# EAGLE design 7Segment-Display-RS232 (EAGLE 6.2)
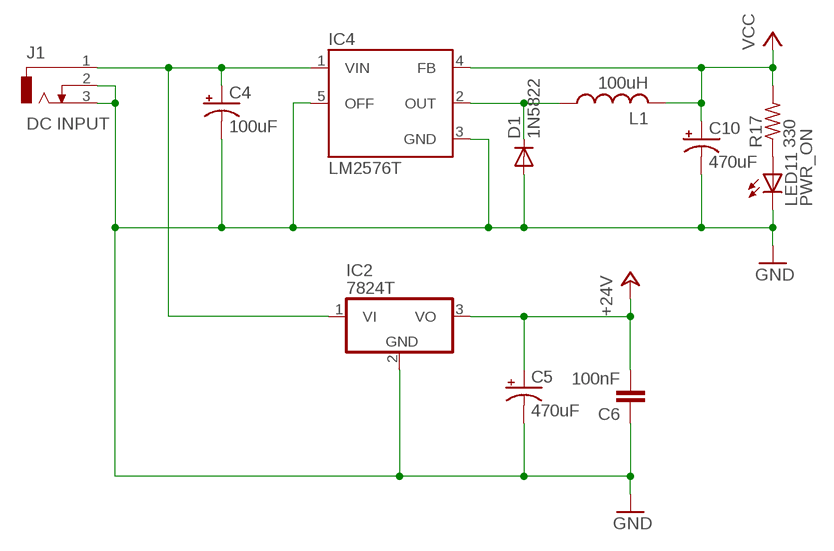
[diagram p0: schematic, sheet 1, part 1 of 2]
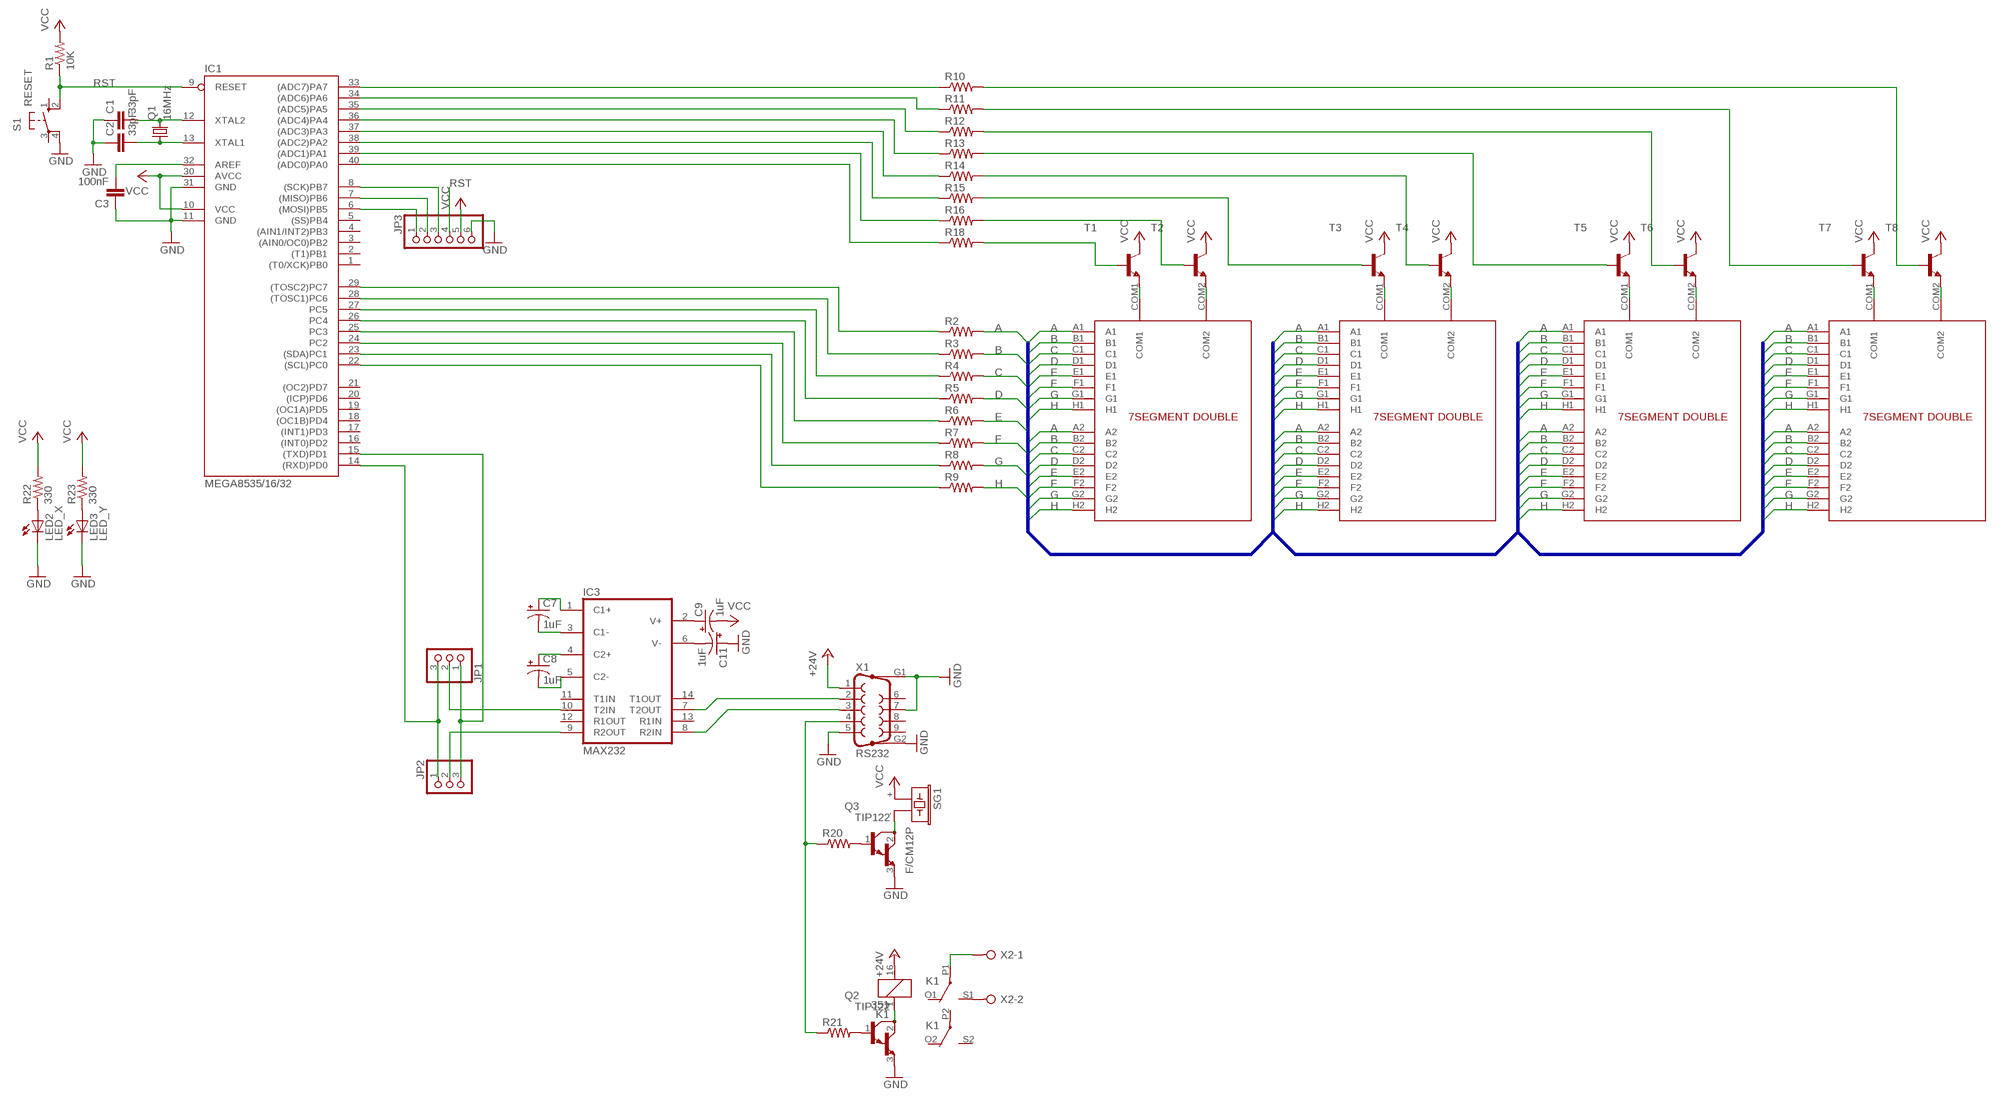
[diagram p1: schematic, sheet 1, part 2 of 2]

## Parts
C1  33pF  C-EU025-024X044  [C025-024X044]
C2  33pF  C-EU025-024X044  [C025-024X044]
C3  100nF  C-EU025-024X044  [C025-024X044]
C4  100uF  CPOL-USE2.5-6  [E2,5-6]
C5  470uF  CPOL-USE3.5-8  [E3,5-8]
C6  100nF  C-EU025-024X044  [C025-024X044]
C7  1uF  CPOL-USE2-4  [E2-4]
C8  1uF  CPOL-USE2-4  [E2-4]
C9  1uF  CPOL-USE2-4  [E2-4]
C10  470uF  CPOL-USE3.5-8  [E3,5-8]
C11  1uF  CPOL-USE2-4  [E2-4]
D1  1N5822  1N5400  [DO201-15]
IC1  MEGA8535/16/32  MEGA8535-P  [DIL40]
IC2  7824T  [TO220H]
IC3  MAX232  [DIL16]
IC4  LM2576T  [TO220-5]
J1  DC INPUT  DCJ0202  [DCJ0202]
JP1  PINHD-1X3  [1X03]
JP2  PINHD-1X3  [1X03]
JP3  PINHD-1X6  [1X06]
K1  351  [351]
L1  100uH  L-USTJ3-U2  [TJ3-U2]
LED2  LED_X  LED3MM  [LED3MM]
LED3  LED_Y  LED3MM  [LED3MM]
LED11  PWR_ON  LED3MM  [LED3MM]
Q1  16MHz  CRYSTALHC49S  [HC49/S]
Q2  TIP122  [TO220]
Q3  TIP122  [TO220]
R1  10K  R-US_0207/10  [0207/10]
R2  R-US_0207/2V  [0207/2V]
R3  R-US_0207/2V  [0207/2V]
R4  R-US_0207/2V  [0207/2V]
R5  R-US_0207/2V  [0207/2V]
R6  R-US_0207/2V  [0207/2V]
R7  R-US_0207/2V  [0207/2V]
R8  R-US_0207/2V  [0207/2V]
R9  R-US_0207/2V  [0207/2V]
R10  R-US_0207/2V  [0207/2V]
R11  R-US_0207/2V  [0207/2V]
R12  R-US_0207/2V  [0207/2V]
R13  R-US_0207/2V  [0207/2V]
R14  R-US_0207/2V  [0207/2V]
R15  R-US_0207/2V  [0207/2V]
R16  R-US_0207/2V  [0207/2V]
R17  330  R-US_0207/2V  [0207/2V]
R18  R-US_0207/2V  [0207/2V]
R20  R-US_0207/2V  [0207/2V]
R21  R-US_0207/2V  [0207/2V]
R22  330  R-US_0207/2V  [0207/2V]
R23  330  R-US_0207/2V  [0207/2V]
S1  RESET  10-XX  [B3F-10XX]
SG1  F/CM12P  [F/CM12P]
T1  2N2222-NPN-TO92-EBC  [TO92-EBC]
T2  2N2222-NPN-TO92-EBC  [TO92-EBC]
T3  2N2222-NPN-TO92-EBC  [TO92-EBC]
T4  2N2222-NPN-TO92-EBC  [TO92-EBC]
T5  2N2222-NPN-TO92-EBC  [TO92-EBC]
T6  2N2222-NPN-TO92-EBC  [TO92-EBC]
T7  2N2222-NPN-TO92-EBC  [TO92-EBC]
T8  2N2222-NPN-TO92-EBC  [TO92-EBC]
U$1  7SEGMENT_DOUBLE  [7SEGMENT_DOUBLE]
U$2  7SEGMENT_DOUBLE  [7SEGMENT_DOUBLE]
U$3  7SEGMENT_DOUBLE  [7SEGMENT_DOUBLE]
U$4  7SEGMENT_DOUBLE  [7SEGMENT_DOUBLE]
X1  RS232  F09HP  [F09HP]
X2  W237-02P  [W237-132]

## Nets
+24V: C5.+ C6.2 IC2.3(VO) K1.16 X1.1
A: R2.2 U$1.A1 U$1.A2 U$2.A1 U$2.A2 U$3.A1 U$3.A2 U$4.A1 U$4.A2
B: R3.2 U$1.B1 U$1.B2 U$2.B1 U$2.B2 U$3.B1 U$3.B2 U$4.B1 U$4.B2
C: R4.2 U$1.C1 U$1.C2 U$2.C1 U$2.C2 U$3.C1 U$3.C2 U$4.C1 U$4.C2
D: R5.2 U$1.D1 U$1.D2 U$2.D1 U$2.D2 U$3.D1 U$3.D2 U$4.D1 U$4.D2
E: R6.2 U$1.E1 U$1.E2 U$2.E1 U$2.E2 U$3.E1 U$3.E2 U$4.E1 U$4.E2
F: R7.2 U$1.F1 U$1.F2 U$2.F1 U$2.F2 U$3.F1 U$3.F2 U$4.F1 U$4.F2
G: R8.2 U$1.G1 U$1.G2 U$2.G1 U$2.G2 U$3.G1 U$3.G2 U$4.G1 U$4.G2
GND: C1.1 C2.1 C3.1 C4.- C5.- C6.1 C10.- C11.+ D1.A IC1.11(GND) IC1.31(GND) IC2.2(GND) IC4.3(GND) IC4.5(OFF) J1.2 J1.3 JP3.6 LED2.K(C) LED3.K(C) LED11.K(C) Q2.3(E) Q3.3(E) S1.4(P1) X1.5 X1.7 X1.G1 X1.G2
H: R9.2 U$1.H1 U$1.H2 U$2.H1 U$2.H2 U$3.H1 U$3.H2 U$4.H1 U$4.H2
N$1: T8.E U$4.COM2
N$2: T7.E U$4.COM1
N$3: C1.2 IC1.12(XTAL2) Q1.2
N$4: T1.E U$1.COM1
N$5: T2.E U$1.COM2
N$6: T3.E U$2.COM1
N$7: T4.E U$2.COM2
N$8: T5.E U$3.COM1
N$9: T6.E U$3.COM2
N$10: C2.2 IC1.13(XTAL1) Q1.1
N$11: C3.2 IC1.32(AREF)
N$12: C4.+ IC2.1(VI) IC4.1(VIN) J1.1
N$13: R18.2 T1.B
N$14: R16.2 T2.B
N$15: R15.2 T3.B
N$16: R14.2 T4.B
N$17: R13.2 T5.B
N$18: R12.2 T6.B
N$19: R11.2 T7.B
N$20: R10.2 T8.B
N$21: IC1.33((ADC7)PA7) R10.1
N$22: IC1.34((ADC6)PA6) R11.1
N$23: IC1.35((ADC5)PA5) R12.1
N$24: IC1.36((ADC4)PA4) R13.1
N$25: IC1.37((ADC3)PA3) R14.1
N$26: IC1.38((ADC2)PA2) R15.1
N$27: IC1.39((ADC1)PA1) R16.1
N$28: IC1.40((ADC0)PA0) R18.1
N$29: IC1.29((TOSC2)PC7) R2.1
N$30: IC1.28((TOSC1)PC6) R3.1
N$31: IC1.27(PC5) R4.1
N$32: D1.C IC4.2(OUT) L1.1
N$33: LED11.A R17.1
N$34: IC1.26(PC4) R5.1
N$35: IC1.25(PC3) R6.1
N$36: IC1.24(PC2) R7.1
N$37: IC1.23((SDA)PC1) R8.1
N$38: IC1.22((SCL)PC0) R9.1
N$39: C7.- IC3.3(C1-)
N$41: Q3.1(B) R20.2
N$42: R20.1 R21.1 X1.4
N$43: Q2.1(B) R21.2
N$44: C8.+ IC3.4(C2+)
N$45: C7.+ IC3.1(C1+)
N$46: C8.- IC3.5(C2-)
N$47: C9.+ IC3.2(V+)
N$48: C11.- IC3.6(V-)
N$49: IC3.7(T2OUT) X1.2
N$50: IC3.8(R2IN) X1.3
N$51: IC1.14((RXD)PD0) JP1.3 JP2.1
N$52: IC1.15((TXD)PD1) JP1.1 JP2.3
N$53: IC3.9(R2OUT) JP2.2
N$54: IC3.10(T2IN) JP1.2
N$55: LED3.A R23.1
N$56: LED2.A R22.1
N$57: IC1.6((MOSI)PB5) JP3.1
N$58: IC1.7((MISO)PB6) JP3.2
N$59: IC1.8((SCK)PB7) JP3.3
N$60: Q3.2(C) SG1.-
N$61: K1.1 Q2.2(C)
N$62: K1.S1(2:S) X2.2
N$63: K1.P1(2:P) X2.1
RST: IC1.9(RESET) JP3.4 R1.1 S1.2(S1)
VCC: C9.- C10.+ IC1.10(VCC) IC1.30(AVCC) IC4.4(FB) JP3.5 L1.2 R1.2 R17.2 R22.2 R23.2 SG1.+ T1.C T2.C T3.C T4.C T5.C T6.C T7.C T8.C
Unconnected: IC1.1((T0/XCK)PB0) IC1.2((T1)PB1) IC1.3((AIN0/OC0)PB2) IC1.4((AIN1/INT2)PB3) IC1.5((SS)PB4) IC1.16((INT0)PD2) IC1.17((INT1)PD3) IC1.18((OC1B)PD4) IC1.19((OC1A)PD5) IC1.20((ICP)PD6) IC1.21((OC2)PD7) IC3.11(T1IN) IC3.12(R1OUT) IC3.13(R1IN) IC3.14(T1OUT) K1.O1(2:O) K1.O2(3:O) K1.P2(3:P) K1.S2(3:S) S1.1(S) S1.3(P) X1.6 X1.8 X1.9

## Buses
7SEG:A,B,C,D,E,F,G,H

## Power pins joined to a net without a drawn wire
GND: IC3.15(GND)
VCC: IC3.16(VCC)

## Library data of the parts
C1-C3 C6 = resistor:C-EU: CAPACITOR, European symbol
C4 C5 C7-C11 = resistor:CPOL-US: POLARIZED CAPACITOR, American symbol
D1 = diode:1N5400: DIODE standard rectifier, 3 A, 50 V (Motorola)
IC1 = atmel:MEGA8535-P: MICROCONTROLLER 8 Kbytes FLASH 512 bytes SRAM 512 bytes EEPROM USART 8-channel 10 bit ADC Source: avr.lbr; MPN: ATMEGA8535-16PU; OC_FARNELL: 9171444; OC_NEWARK: 01M6909
IC2 = linear:78*: Positive VOLTAGE REGULATOR Source: http://cache.national.com/ds/LM/LM78L05.pdf http://www.fairchildsemi.com/ds/LM/LM7805.pdf
IC3 = maxim:MAX232: RS232 TRANSEIVER; MF: MAXIM; MPN: MAX232ACPE+; OC_FARNELL: 9723773; OC_NEWARK: 68K4544
IC4 = v-reg-3:LM2576: National Semiconductor <http://www.national.com> 3.0A "Simple Switcher"(c) 52kHz, Vout 1.23-37V (HV: 57V), Vin 40V (HV: 60V), 50µA standby current
J1 = con-jack:DCJ0202: DC POWER JACK Source: DCJ0202.pdf; OC_FARNELL: unknown; OC_NEWARK: unknown
JP1 JP2 = pinhead:PINHD-1X3: PIN HEADER
JP3 = pinhead:PINHD-1X6: PIN HEADER
K1 = relay:351: RELAY 2 x switch, Omron; OC_FARNELL: unknown; OC_NEWARK: unknown
L1 = resistor:L-US: INDUCTOR, American symbol
LED2 LED3 LED11 = led:LED: LED OSRAM: - CHIPLED LG R971, LG N971, LY N971, LG Q971, LY Q971, LO R971, LY R971 LH N974, LH R974 LS Q976, LO Q976, LY Q976 LO Q996 - Hyper CHIPLED LW Q18S LB Q993, LB Q99A, LB R99A - SideLED LS A670, LO A670, LY A670, LG A670, LP A670 LB A673, LV A673, LT A673, LW A673 LH A674 LY A675 LS A676, LA A676, LO A676, LY A676, LW A676 LS A679, LY A679, LG A679 - Hyper Micro SIDELED® LS Y876, LA Y876, LO Y876, LY Y876 LT Y87S - SmartLED LW L88C, LW L88S LB L89C, LB L89S, LG L890 LS L89K, LO L89K, LY L89K LS L896, LA L896, LO L896, LY L896 - TOPLED LS T670, LO T670, LY T670, LG T670, LP T670 LSG T670, LSP T670, LSY T670, LOP T670, LYG T670 LG T671, LOG T671, LSG T671 LB T673, LV T673, LT T673, LW T673 LH T674 LS T676, LA T676, LO T676, LY T676, LB T676, LH T676, LSB T676, LW T676 LB T67C, LV T67C, LT T67C, LS T67K, LO T67K, LY T67K, LW E67C LS E67B, LA E67B, LO E67B, LY E67B, LB E67C, LV E67C, LT E67C LW T67C LS T679, LY T679, LG T679 LS T770, LO T770, LY T770, LG T770, LP T770 LB T773, LV T773, LT T773, LW T773 LH T774 LS E675, LA E675, LY E675, LS T675 LS T776, LA T776, LO T776, LY T776, LB T776 LHGB T686 LT T68C, LB T68C - Hyper Mini TOPLED® LB M676 - Mini TOPLED Santana® LG M470 LS M47K, LO M47K, LY M47K Source: http://www.osram.convergy.de LUXEON: - LUMILED® LXK2-PW12-R00, LXK2-PW12-S00, LXK2-PW14-U00, LXK2-PW14-V00 LXK2-PM12-R00, LXK2-PM12-S00, LXK2-PM14-U00 LXK2-PE12-Q00, LXK2-PE12-R00, LXK2-PE12-S00, LXK2-PE14-T00, LXK2-PE14-U00 LXK2-PB12-K00, LXK2-PB12-L00, LXK2-PB12-M00, LXK2-PB14-N00, LXK2-PB14-P00, LXK2-PB14-Q00 LXK2-PR12-L00, LXK2-PR12-M00, LXK2-PR14-Q00, LXK2-PR14-R00 LXK2-PD12-Q00, LXK2-PD12-R00, LXK2-PD12-S00 LXK2-PH12-R00, LXK2-PH12-S00 LXK2-PL12-P00, LXK2-PL12-Q00, LXK2-PL12-R00 Source: www.luxeon.com KINGBRIGHT: KA-3528ASYC Source: www.kingbright.com
Q1 = crystal:CRYSTAL: CRYSTAL; OC_FARNELL: 1667008; OC_NEWARK: unknown
Q2 Q3 = transistor-npn:TIP122*: NPN Darlington Transistor
R1-R18 R20-R23 = resistor:R-US_: RESISTOR, American symbol
S1 = switch-omron:10-XX: OMRON SWITCH; MPN: B3F-1000; OC_FARNELL: 176432; OC_NEWARK: 36M3542
SG1 = buzzer:F/CM12P: BUZZER Source: Buerklin; OC_FARNELL: unknown; OC_NEWARK: unknown
T1-T8 = transistor-neu-to92:*-NPN-: NPN Transistror
U$1-U$4 = 7SEGMENT_DOUBLE:7SEGMENT_DOUBLE
X1 = con-subd:F09HP: SUB-D; OC_FARNELL: unknown; OC_NEWARK: unknown
X2 = con-wago-508:W237-02P: WAGO SREW CLAMP; OC_FARNELL: unknown; OC_NEWARK: unknown

## Board
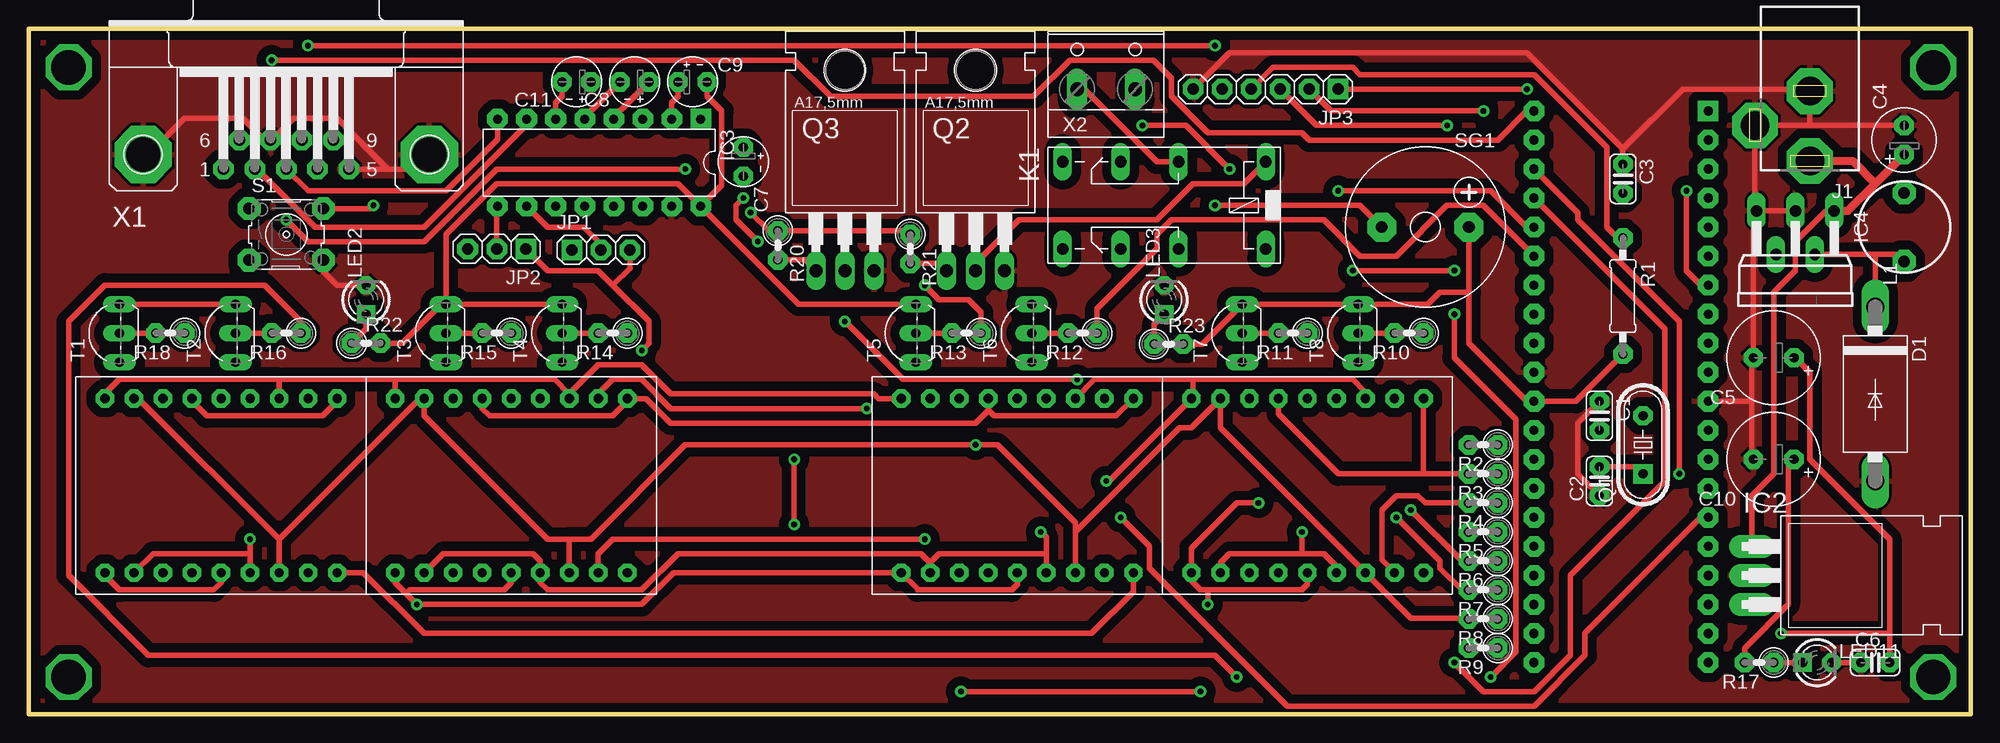
[diagram p2: board, top side]
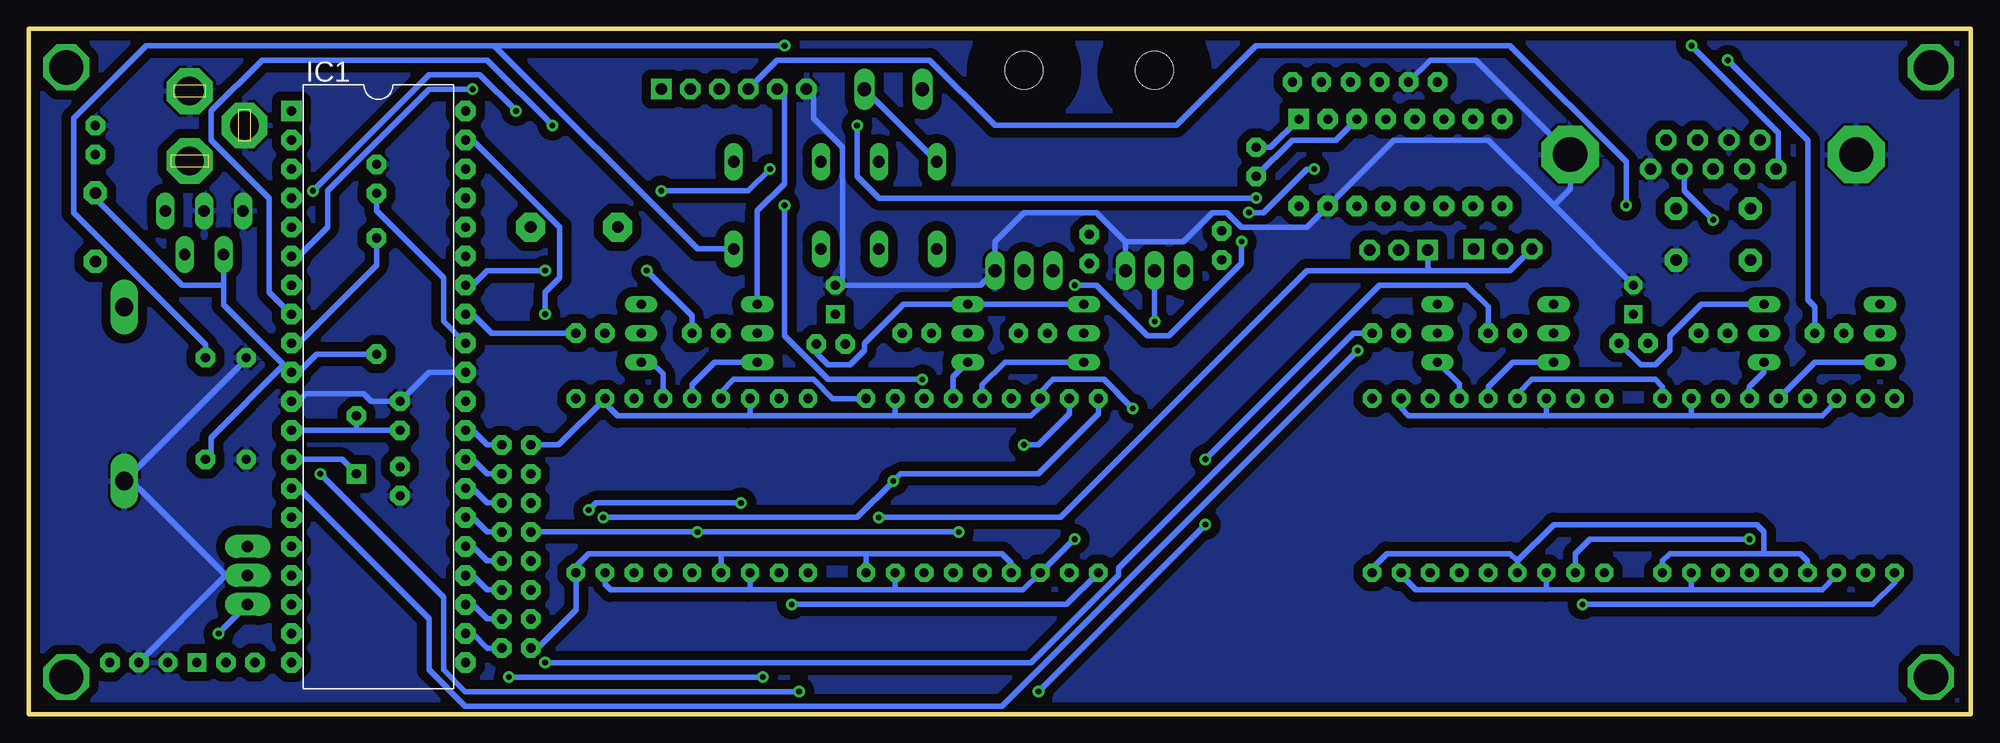
[diagram p3: board, bottom side, seen from below]

Size 170 x 60 mm. Coordinates in mm from the lower left corner, seen from the top.
Outline: 0,60 0,0 170,0 170,60 0,60
Copper layers (1*16): Top 0.035mm / dielectric 1.5mm / Bottom 0.035mm
Design rules: minimum track width 0.5mm, minimum drill 0.5mm, track to track 10mil, track to pad 10mil, pad to pad 8mil, via to via 8mil, smd to smd 8mil, copper to edge 10mil, drill to drill 8mil, minimum pad ring 12mil, minimum via ring 10mil, stop-mask expansion 4mil, vias tented up to drill 25mil, thermal gap 10mil

### Footprints (pad centres in the part's own frame; a part is rotated, then mirrored left to right if it is on the bottom)
C025-024X044 = drill 0.8 pad 1.7 octagon: 1 -1.27,0; 2 1.27,0
E2,5-6 = drill 0.8 pad 1.7 octagon: + -1.27,0; - 1.27,0
E3,5-8 = drill 0.813 pad 1.7 octagon: + -1.778,0; - 1.778,0
E2-4 = drill 0.8 pad 1.7 octagon: + -1.27,0; - 1.27,0
DO201-15 = drill 1.6 long: A 7.62,0; C -7.62,0
DIL40 = drill 0.8 pad 1.8 square: 1 -24.13,-7.62 | drill 0.8 pad 1.8 octagon: 2 -21.59,-7.62; 3 -19.05,-7.62; 4 -16.51,-7.62; 5 -13.97,-7.62; 6 -11.43,-7.62; 7 -8.89,-7.62; 8 -6.35,-7.62; 9 -3.81,-7.62; 10 -1.27,-7.62; 11 1.27,-7.62; 12 3.81,-7.62; 13 6.35,-7.62; 14 8.89,-7.62; 15 11.43,-7.62; 16 13.97,-7.62; 17 16.51,-7.62; 18 19.05,-7.62; 19 21.59,-7.62; 20 24.13,-7.62; 21 24.13,7.62; 22 21.59,7.62; 23 19.05,7.62; 24 16.51,7.62; 25 13.97,7.62; 26 11.43,7.62; 27 8.89,7.62; 28 6.35,7.62; 29 3.81,7.62; 30 1.27,7.62; 31 -1.27,7.62; 32 -3.81,7.62; 33 -6.35,7.62; 34 -8.89,7.62; 35 -11.43,7.62; 36 -13.97,7.62; 37 -16.51,7.62; 38 -19.05,7.62; 39 -21.59,7.62; 40 -24.13,7.62
TO220H = drill 1 pad 2 long: 1 -2.54,-10.16; 2 0,-10.16; 3 2.54,-10.16
DIL16 = drill 0.8 pad 1.8 square: 1 -8.89,-3.81 | drill 0.8 pad 1.8 octagon: 2 -6.35,-3.81; 3 -3.81,-3.81; 4 -1.27,-3.81; 5 1.27,-3.81; 6 3.81,-3.81; 7 6.35,-3.81; 8 8.89,-3.81; 9 8.89,3.81; 10 6.35,3.81; 11 3.81,3.81; 12 1.27,3.81; 13 -1.27,3.81; 14 -3.81,3.81; 15 -6.35,3.81; 16 -8.89,3.81
TO220-5 = drill 1 long: 1 -3.4,-8.4; 2 -1.7,-4.59; 3 0,-8.4; 4 1.7,-4.59; 5 3.4,-8.4
DCJ0202 = drill 2.5 pad 4 octagon: 1 0,3.1; 2 4.8,0; 3 0,-3
1X03 = drill 1 pad 1.8 square: 1 -2.54,0 | drill 1 pad 1.8 octagon: 2 0,0; 3 2.54,0
1X06 = drill 1 pad 1.8 square: 1 -6.35,0 | drill 1 pad 1.8 octagon: 2 -3.81,0; 3 -1.27,0; 4 1.27,0; 5 3.81,0; 6 6.35,0
351 = drill 1.016 long: 1 -3.81,-3.81; 16 -3.81,3.81; O1 8.89,-3.81; O2 8.89,3.81; P1 3.81,-3.81; P2 3.81,3.81; S1 13.97,-3.81; S2 13.97,3.81
TJ3-U2 = drill 1 pad 2 octagon: 1 -3,0; 2 3,0
LED3MM = drill 0.8 pad 1.6 square: A -1.27,0 | drill 0.8 pad 1.6 octagon: K 1.27,0
HC49/S = drill 0.8 pad 1.7 square: 1 -2.54,0 | drill 0.8 pad 1.7 octagon: 2 2.54,0
TO220 = drill 1.118 long: 1 -2.54,-6.35; 2 0,-6.35; 3 2.54,-6.35 | hole 3.302: 0,11.176
0207/10 = drill 0.8 pad 1.7 octagon: 1 -5.08,0; 2 5.08,0
0207/2V = drill 0.813 pad 1.7 octagon: 1 -1.27,0; 2 1.27,0
B3F-10XX = drill 1 pad 2 octagon: 1 -3.251,2.261; 2 3.251,2.261; 3 -3.251,-2.261; 4 3.251,-2.261
F/CM12P = drill 1.016 pad 2.54 octagon: + 3.81,0; - -3.81,0
TO92-EBC = drill 0.813 long: B 0,-1.27; C 2.54,-1.27; E -2.54,-1.27
7SEGMENT_DOUBLE = drill 0.8 pad 1.6 octagon: A1 -5.08,8.255; A2 7.62,8.255; B1 -2.54,8.255; B2 10.16,8.255; C1 -5.08,-6.985; C2 7.62,-6.985; COM1 0,8.255; COM2 2.54,8.255; D1 -7.62,-6.985; D2 2.54,-6.985; E1 -10.16,-6.985; E2 0,-6.985; F1 -10.16,8.255; F2 5.08,8.255; G1 -7.62,8.255; G2 5.08,-6.985; H1 -2.54,-6.985; H2 10.16,-6.985
F09HP = drill 1 pad 1.8 octagon: 1 -5.486,-1.27; 2 -2.743,-1.27; 3 0,-1.27; 4 2.743,-1.27; 5 5.486,-1.27; 6 -4.115,1.27; 7 -1.372,1.27; 8 1.372,1.27; 9 4.115,1.27 | drill 3 pad 5 octagon: G1 -12.522,0; G2 12.522,0
W237-132 = drill 1.194 long: 1 -2.54,-0.635; 2 2.54,-0.635

### Placement (x,y rotation side)
C1  137.49,26.12 270 top
C2  137.49,20.41 90 top
C3  139.54,46.84 270 top
C4  164.16,50.25 90 top
C5  152.73,31.2 180 top
C6  161.62,4.53 0 top
C7  62.56,48.34 270 top
C8  53.03,55.33 180 top
C9  58.12,55.33 0 top
C10  152.73,22.31 180 top
C11  47.96,55.33 180 top
D1  161.62,28.03 270 top
IC1  139.38,28.66 270 bottom
IC2  160.99,12.15 270 top
IC3  49.94,48.27 180 top
IC4  154.63,35.64 180 top
J1  155.91,51.52 180 top
JP1  50.09,40.64 0 top
JP2  40.97,40.72 180 top
JP3  108.26,54.69 180 top
K1  104.47,44.53 180 top
L1  164.16,42.63 90 top
LED2  29.54,36.28 90 top
LED3  99.39,36.28 90 top
LED11  156.54,4.53 0 top
Q1  141.3,23.58 90 top
Q2  82.88,45.17 0 top
Q3  71.45,45.17 0 top
R1  139.54,36.59 270 top
R2  127.31,23.58 180 top
R3  127.31,21.04 180 top
R4  127.31,18.5 180 top
R5  127.31,15.96 180 top
R6  127.31,13.42 180 top
R7  127.31,10.88 180 top
R8  127.31,8.34 180 top
R9  127.31,5.8 180 top
R10  120.82,33.34 180 top
R11  110.66,33.34 180 top
R12  92.25,33.34 180 top
R13  82.09,33.34 180 top
R14  51.13,33.34 180 top
R15  40.97,33.34 180 top
R16  22.56,33.34 180 top
R17  151.46,4.53 180 top
R18  12.4,33.34 180 top
R20  65.58,41.03 270 top
R21  77.16,40.72 270 top
R22  29.54,32.47 0 top
R23  99.78,32.39 0 top
S1  22.56,42 0 top
SG1  122.25,42.63 0 top
T1  6.69,33.34 90 top
T2  16.84,33.34 90 top
T3  35.26,33.34 90 top
T4  45.42,33.34 90 top
T5  76.38,33.34 90 top
T6  86.53,33.34 90 top
T7  104.95,33.34 90 top
T8  115.11,33.34 90 top
U$1  16.84,19.38 0 top
U$2  42.25,19.38 0 top
U$3  86.53,19.38 0 top
U$4  111.94,19.38 0 top
X1  22.56,48.98 0 top
X2  94.31,55.33 0 top

### Tracks (layer width: path | path; a pad name or v marks a point on that pad's centre or on a via)
+24V  (via drill 0.5)
  Top 0.5: 162.89,7.07 162.89,15.33 155.91,22.31 155.91,29.93 154.63,31.2 C5.+ | 162.89,7.07 C6.2 | v103.84,58.5 v24.46,58.5 | 162.89,7.07 v153.37,7.07
  Bottom 0.5: K1.16 111.46,40.72 129.24,58.5 | 129.24,58.5 159.71,58.5 166.06,52.16 166.06,43.9 154.51,32.34 C5.+ | v24.46,58.5 16.84,50.89 16.84,47.71 X1.1 | 129.24,58.5 v103.84,58.5 | v153.37,7.07 IC2.3
A  (via drill 0.5)
  Top 0.5: v73.35,26.75 56.21,26.75 53.67,29.3 51.13,29.3 49.87,28.03 U$2.A2
  Bottom 0.5: 24.46,26.12 13.03,26.12 11.77,27.39 U$1.A1 | 24.46,26.12 37.16,26.12 | 37.16,26.12 49.22,26.12 49.87,26.76 U$2.A2 | R2.2 123.6,23.58 U$4.A2 119.56,27.23 118.44,26.12 107.01,26.12 | 94.31,26.12 82.25,26.12 81.46,26.91 U$3.A1 81.46,28.18 80.34,29.3 75.9,29.3 v73.35,26.75 | 94.31,26.12 107.01,26.12 | U$1.A2 24.47,26.12 24.46,26.12 | U$2.A1 37.16,26.12 | U$3.A2 94.16,26.28 94.31,26.12 | U$4.A1 106.85,26.28 107.01,26.12
B
  Top 0.5: R3.2 122.25,21.04 | 122.25,21.04 114.63,21.04 109.4,26.28 U$4.B1 | U$1.B1 14.31,27.39 15.57,26.12 25.73,26.12 27,27.39 U$1.B2 | U$2.B1 39.71,26.75 40.34,26.12 51.13,26.12 52.41,27.39 U$2.B2 54.06,27.63 56.21,25.48 82.88,25.48 84,26.6 | U$4.B2 122.09,21.19 122.25,21.04 | U$3.B1 84,26.6 | 84,26.6 84.47,26.12 95.19,26.12 U$3.B2
  Bottom 0.5: U$1.B2 27,28.67 27.64,29.3 38.43,29.3 39.71,28.02 U$2.B1 | U$3.B2 99.63,27.63 101.29,29.3 108.28,29.3 109.4,28.18 U$4.B1
C  (via drill 0.5)
  Top 0.5: R4.2 122.25,18.5 121.62,19.14 119.71,19.14 118.44,17.87 118.44,13.51 U$4.C2 | v78.44,15.33 51.13,15.33 49.87,14.06 U$2.C2
  Bottom 0.5: 24.46,10.88 13.03,10.88 11.77,12.15 U$1.C1 | 24.46,10.88 37.16,10.88 | 37.16,10.88 48.59,10.88 49.87,12.16 U$2.C2 | 94.31,10.88 82.97,10.88 U$3.C1 78.52,15.33 v78.44,15.33 | 94.31,10.88 107.01,10.88 | 107.01,10.88 119.07,10.88 119.56,11.36 U$4.C2 | U$1.C2 24.47,10.88 24.46,10.88 | U$2.C1 37.16,10.88 | U$3.C2 94.16,11.03 94.31,10.88 | U$4.C1 106.85,11.03 107.01,10.88
D  (via drill 0.5)
  Top 0.5: 111.46,14.05 105.1,14.05 104.31,13.27 U$4.D1 | 111.46,14.05 v111.46,15.96 | 89.07,14.05 79.71,14.05 78.91,13.27 | 19.39,14.05 10.89,14.05 U$1.D1 | U$1.D2 19.39,14.05 | 19.39,14.05 v19.39,15.32 v19.38,15.33 | U$3.D1 78.91,13.27 | 78.91,13.27 78.12,14.05 56.84,14.05 53.67,10.88 45.41,10.88 44.78,11.51 U$2.D2 44.78,13.41 44.15,14.05 36.53,14.05 36.29,14.05 U$2.D1 | U$3.D2 89.07,14.05 | 89.07,14.05 89.07,15.48 v88.59,15.96 | U$4.D2 114.47,12.94 113.36,14.05 111.46,14.05
  Bottom 0.5: R5.2 v111.46,15.96 v88.59,15.96 | v19.38,15.33 33.35,15.33 34.62,14.05 U$2.D1
E  (via drill 0.5)
  Top 0.5: 103.2,10.88 111.46,10.88 111.94,11.36 U$4.E2 | v120.98,17.87 125.43,13.42 R6.2 | v103.2,9.61 103.2,10.88 | U$1.E1 6.69,12.15 7.95,10.88 16.2,10.88 16.84,11.52 U$1.E2 | U$2.E1 32.09,11.51 33.03,10.56 | 33.03,10.56 v33.99,9.61 53.67,9.61 56.45,12.39 U$3.E1 77.8,10.97 77.8,10.88 86.06,10.88 86.53,11.36 U$3.E2 | 33.03,10.56 33.35,10.88 41.6,10.88 42.25,11.52 U$2.E2 | v107.65,18.5 105.74,18.5 101.78,14.53 U$4.E1 101.78,11.67 102.56,10.88 103.2,10.88
  Bottom 0.5: v120.98,17.87 120.34,18.5 v107.65,18.5 | v33.99,9.61 8.58,9.61 6.69,11.51 U$1.E1 | v103.2,9.61 79.16,9.61 U$3.E1
F  (via drill 0.5)
  Top 0.5: 101.93,29.3 93.28,29.3 U$3.F2 | 101.93,29.3 115.9,29.3 117.01,28.18 U$4.F2 | 21.92,29.3 7.95,29.3 6.69,28.03 U$1.F1 | 21.92,29.3 32.08,29.3 | 32.08,29.3 46.05,29.3 47.32,28.02 U$2.F2 47.32,28.03 49.86,30.56 53.67,30.56 56.21,28.03 73.99,28.03 74.38,27.63 U$3.F1 | v119.71,17.23 123.52,13.42 123.52,12.78 125.43,10.88 R7.2 | U$1.F2 21.92,29.29 21.92,29.3 | U$2.F1 32.09,29.29 32.08,29.3 | v94.31,20.41 94.55,20.41 U$4.F1 101.93,27.78 101.93,29.3
  Bottom 0.5: v119.71,17.23 97.49,17.23 v94.31,20.41 93.68,21.04 81.61,21.04 76.38,26.28 U$3.F1
G  (via drill 0.5)
  Top 0.5: 21.92,15.32 9.61,27.63 U$1.G1 | 47.32,15.33 49.22,15.33 57.48,23.58 v82.88,23.58 84.78,23.58 91.62,16.75 91.62,15.96 | U$1.G2 21.92,15.32 | U$2.G2 47.32,15.32 47.32,15.33 | R8.2 125.96,8.42 120.98,8.42 U$4.G2 104.31,25.09 U$4.G1 101.78,25.09 100.75,25.09 91.62,15.96 | U$3.G2 91.62,15.96 | 21.92,15.32 34.24,27.63 U$2.G1 34.62,26.11 45.41,15.33 47.32,15.33
  Bottom 0.5: U$3.G1 78.91,26.28 81.61,23.58 v82.88,23.58
GND
  Top 0.5: 155.91,51.52 J1.2 151.1,44.17 IC4.5 | 155.91,51.52 C4.- | 155.91,51.52 J1.3 155.91,54.69 144.78,54.69 139.54,49.47 | C6.1 LED11.K | C2.1 135.59,21.04 135.59,25.48 C1.1 | 150.82,27.39 150.82,22.31 C10.- | 150.82,27.39 IC1.11 | X1.G1 10.49,48.98 13.67,52.16 18.75,52.16 20.65,50.25 X1.7 21.28,50.25 23.19,52.16 27,52.16 31.44,47.71 | LED2.K 27,37.55 25.81,38.74 S1.4 | 31.44,47.71 33.35,47.71 34.62,48.98 X1.G2 | 31.44,47.71 X1.5 | 139.54,49.47 131.14,57.87 105.1,57.87 101.93,54.69 JP3.6 | C3.1 139.54,49.47 | IC4.3 IC4.5 | IC4.5 150.95,43.76 C5.- 150.82,31.07 150.82,27.39
  Bottom 0.5: C6.1 152.73,12.15 | IC1.31 134.95,29.93 C1.1 140.03,27.39 140.66,28.03 145.75,28.03 146.38,27.39 IC1.11 | 160.99,21.04 150.82,31.2 C5.- | 152.73,12.15 160.99,20.41 160.99,21.04 | 152.73,12.15 IC2.2 | 160.99,21.04 D1.A | 98.75,37.55 86.69,37.55 Q2.3 85.42,41.36 82.88,43.9 76.53,43.9 73.99,41.36 | 73.99,41.36 Q3.3 | 98.75,37.55 98.75,49.61 101.29,52.16 101.29,54.69 JP3.6 | 98.75,37.55 LED3.K | C11.+ 47.32,57.23 43.33,57.23 X1.G2 35.08,45.98 36.53,44.53 | 36.53,44.53 42.24,50.25 50.5,50.25 IC3.15 58.12,42.64 58.12,42.63 63.83,42.63 65.1,43.9 66.37,43.9 68.91,41.36 73.99,41.36 | 36.53,44.53 LED2.K
  pour Bottom (isolate 0.8): 0,60 170,60 170,0 0,0
  pour Top (isolate 0.8): 0,60 170,60 170,0 0,0
H
  Top 0.5: U$1.H2 29.3,12.39 34.62,7.07 93.04,7.07 96.69,10.73 U$3.H2
  Bottom 0.5: 18.11,14.05 26.36,14.05 27,13.41 U$1.H2 | 18.11,14.05 14.94,14.05 14.31,13.42 U$1.H1 | 18.11,14.05 18.11,15.96 18.75,16.59 36.53,16.59 39.71,13.41 | R9.2 125.43,5.8 122.09,9.13 U$4.H2 122.09,12.94 120.98,14.05 109.55,14.05 | 96.85,14.05 84.78,14.05 84,13.27 U$3.H1 | 96.85,14.05 109.55,14.05 | U$2.H1 39.71,13.41 | 39.71,13.41 40.34,14.05 51.13,14.05 52.41,12.78 U$2.H2 | U$3.H2 96.69,13.9 96.85,14.05 | U$4.H1 109.4,13.9 109.55,14.05
N$1
  Bottom 0.5: T8.E 115.5,30.81 114.47,29.78 U$4.COM2
N$2
  Bottom 0.5: T7.E 109.94,30.81 111.94,28.81 U$4.COM1
N$3
  Bottom 0.5: IC1.12 141.3,24.85 | 141.3,24.85 C1.2 | 141.3,24.85 Q1.2
N$4
  Bottom 0.5: T1.E 13.67,30.81 U$1.COM1
N$5
  Bottom 0.5: T2.E 18.11,29.92 19.38,28.66 U$1.COM2
N$6
  Bottom 0.5: T3.E 40.09,30.81 42.24,28.66 U$2.COM1
N$7
  Bottom 0.5: U$2.COM2 44.78,28.9 T4.E
N$8
  Bottom 0.5: T5.E 84.54,30.81 86.53,28.81 U$3.COM1
N$9
  Bottom 0.5: T6.E 89.07,29.53 U$3.COM2
N$10
  Top 0.5: C2.2 140.66,21.67 Q1.1
  Bottom 0.5: IC1.13 142.57,22.31 Q1.1
N$11
  Bottom 0.5: IC1.32 131.78,32.47 133.68,34.38 133.68,38.19 139.54,44.05 C3.2
N$12
  Top 0.5: IC2.1 150.82,19.14 152.73,21.04 152.73,36.92 154.63,38.82 154.63,41.36 157.32,44.05 IC4.1
  Top 0.7: IC4.1 159.23,44.05 161.62,46.44 | 161.62,46.44 C4.+ | J1.1 159.64,48.42 161.62,46.44
N$13
  Top 0.5: T1.B R18.2
N$14
  Top 0.5: T2.B R16.2
N$15
  Top 0.5: T3.B R15.2
N$16
  Top 0.5: T4.B R14.2
N$17
  Top 0.5: T5.B R13.2
N$18
  Top 0.5: T6.B R12.2
N$19
  Top 0.5: T7.B R11.2
N$20
  Top 0.5: T8.B R10.2
N$21
  Bottom 0.5: IC1.33 131.14,35.01 129.47,33.34 R10.1
N$22  (via drill 0.5)
  Top 0.5: v124.79,38.82 v115.9,38.82
  Bottom 0.5: v115.9,38.82 111.94,34.86 R11.1 | v124.79,38.82 129.87,38.82 131.14,37.55 IC1.34
N$23
  Top 0.5: IC1.35 131.78,40.09 127.33,44.53 124.16,44.53 119.71,40.09 116.53,40.09 113.36,43.27 100.03,43.27 98.75,42 98.75,40.72 93.52,35.49 R12.1
N$24  (via drill 0.5)
  Top 0.5: v78.44,37.55 79.71,36.28 82.25,36.28 83.36,35.17 R13.1 | v63.83,41.36 61.93,43.27 61.93,44.53 v62.56,45.17 | v97.49,51.52 101.29,51.52 v105.1,47.71 | v114.63,45.81 127.97,45.81 131.14,42.63 IC1.36
  Bottom 0.5: v78.44,37.55 76.53,37.55 72.09,33.11 70.18,33.11 63.83,39.45 v63.83,41.36 | v62.56,45.17 95.58,45.17 97.49,47.08 v97.49,51.52 | v105.1,47.71 107.01,45.81 v114.63,45.81
N$25  (via drill 0.5)
  Top 0.5: v124.79,4.53 127.33,1.99 131.78,1.99 134.95,5.16 134.95,12.15 143.21,20.41 143.21,33.74 131.78,45.17 IC1.37
  Bottom 0.5: v124.79,4.53 82.25,4.53 74.62,12.15 74.62,12.78 54.06,33.34 R14.1
N$26  (via drill 0.5)
  Top 0.5: v67,16.59 v67,22.31 | v102.56,1.99 v81.61,1.99 | v144.47,21.04 144.47,34.38 135.59,43.27 135.59,43.9 131.78,47.71 IC1.38
  Bottom 0.5: v67,22.31 51.76,37.55 44.15,37.55 42.25,35.65 R15.1 | v81.61,1.99 v67,16.59 | v102.56,1.99 131.78,1.99 133.68,3.9 133.68,10.24 v144.47,21.04
N$27  (via drill 0.5)
  Top 0.5: v127.97,3.26 130.19,5.48 130.19,25.8 124.79,31.2 v124.79,35.01 | R16.1 23.83,34.37 20.65,37.55 6.68,37.55 3.5,34.38 3.5,12.15 10.49,5.16 103.84,5.16 v105.74,3.26
  Bottom 0.5: v127.97,3.26 v105.74,3.26 | v124.79,35.01 124.79,36.92 123.52,38.19 123.52,42.63 131.14,50.25 IC1.39
N$28  (via drill 0.5)
  Top 0.5: v21.28,57.23 67,57.23 70.18,54.06 87.96,54.06 91.13,57.23 98.44,57.23 100.03,55.65 100.03,54.06 103.2,50.89 111.46,50.89 112.09,50.25 128.6,50.25 131.14,52.79 IC1.40
  Bottom 0.5: v21.28,57.23 14.3,50.25 14.3,36.28 13.67,35.65 R18.1
N$29
  Bottom 0.5: R2.1 129.87,23.58 131.14,24.85 IC1.29
N$30
  Bottom 0.5: R3.1 129.87,21.04 131.14,22.31 IC1.28
N$31
  Bottom 0.5: R4.1 129.87,18.5 131.14,19.77 IC1.27
N$32
  Top 0.5: IC4.2 161.62,40.23 | 161.62,40.23 163.56,40.23 L1.1 | D1.C 161.62,40.23
N$33
  Top 0.5: R17.1 LED11.A
N$34
  Bottom 0.5: R5.1 129.87,15.96 131.14,17.23 IC1.26
N$35
  Bottom 0.5: R6.1 129.87,13.42 131.14,14.69 IC1.25
N$36
  Bottom 0.5: R7.1 129.87,10.88 131.14,12.15 IC1.24
N$37
  Bottom 0.5: R8.1 129.87,8.34 131.14,9.61 IC1.23
N$38
  Bottom 0.5: R9.1 129.87,5.8 131.14,7.07 IC1.22
N$39
  Bottom 0.5: IC3.3 55.57,50.25 59.38,50.25 C7.-
N$40  (via drill 3)
  other vias: 3.5,56.6
N$41
  Top 0.5: R20.2 67.97,39.77 Q3.1
N$42  (via drill 0.5)
  Top 0.5: v22.56,43.27 24.46,41.36 34.62,41.36 40.97,47.71 v57.48,47.71 | v63.19,43.9 64.79,42.31 R20.1 76.85,42.31 R21.1
  Bottom 0.5: v22.56,43.27 25.09,45.81 25.09,47.71 X1.4 | v57.48,47.71 58.12,47.71 61.93,43.9 v63.19,43.9
N$43
  Top 0.5: R21.2 79.71,39.45 Q2.1
N$44
  Top 0.5: IC3.4 51.21,52.23 C8.+
N$45
  Bottom 0.5: C7.+ 61.29,49.61 IC3.1
N$46
  Top 0.5: IC3.5 48.67,52.23 C8.-
N$47
  Top 0.5: IC3.2 56.29,53.5 56.84,54.06 C9.+
N$48
  Top 0.5: IC3.6 46.13,53.5 46.69,54.06 C11.-
N$49
  Top 0.5: X1.2 20.02,47.71 25.09,42.63 34.62,42.63 43.59,51.6 IC3.7
N$50
  Top 0.5: X1.3 24.46,45.81 36.53,45.81 41.05,50.33 IC3.8
N$51  (via drill 0.5)
  Top 0.5: JP2.1 45.41,38.82 49.86,38.82 51.13,37.55 | v53.67,31.83 54.31,32.47 54.31,34.38 51.13,37.55 | JP1.3 52.63,39.05 51.13,37.55
  Bottom 0.5: v53.67,31.83 84.78,0.72 131.78,0.72 134.95,3.9 134.95,8.34 146.38,19.77 IC1.14
N$52  (via drill 0.5)
  Top 0.5: v95.58,17.23 98.12,14.69 98.12,12.78 110.19,0.72 131.78,0.72 136.22,5.16 136.22,7.07 146.38,17.23 IC1.15
  Bottom 0.5: v95.58,17.23 79.71,17.23 58.12,38.82 47.32,38.82 | JP2.3 40.34,38.82 47.32,38.82 | JP1.1 47.55,39.05 47.32,38.82
N$53
  Top 0.5: JP2.2 40.97,44.38 IC3.9
N$54
  Top 0.5: IC3.10 45.42,42.63 48.59,42.63 50.09,41.13 JP1.2
N$55
  Top 0.5: R23.1 98.51,34.14 LED3.A
N$56
  Top 0.5: LED2.A 29.54,33.74 R22.1
N$57  (via drill 0.5)
  Top 0.5: v131.14,54.69 JP3.1
  Bottom 0.5: v131.14,54.69 134.95,54.69 143.84,45.81 143.84,42.63 146.38,40.09 IC1.6
N$58  (via drill 0.5)
  Top 0.5: v127.33,52.79 114,52.79 112.09,54.69 JP3.2 | v145.11,45.81 145.11,38.82 146.38,37.55 IC1.7
  Bottom 0.5: v127.33,52.79 130.5,55.97 134.95,55.97 v145.11,45.81
N$59  (via drill 0.5)
  Top 0.5: v124.16,51.52 112.72,51.52 109.55,54.69 JP3.3
  Bottom 0.5: v124.16,51.52 129.87,57.23 149.56,57.23 154,52.79 154,50.25 148.92,45.17 148.92,36.92 147.01,35.01 IC1.8
N$60  (via drill 0.5)
  Top 0.5: v71.45,34.38 76.53,29.3 v91.77,29.3 | v103.84,44.53 116.53,44.53 SG1.-
  Bottom 0.5: v71.45,34.38 Q3.2 | v91.77,29.3 100.03,29.3 103.84,33.11 v103.84,44.53
N$61
  Top 0.5: K1.1 106.38,46.44 101.93,46.44 98.75,43.27 86.69,43.27 82.88,39.45 Q2.2
N$62
  Bottom 0.5: X2.2 K1.S1
N$63
  Top 0.5: K1.P1 98.75,48.34 92.41,54.69 X2.1
N$64  (via drill 3)
  other vias: 166.7,56.6
N$65  (via drill 3)
  other vias: 166.7,3.26
N$66  (via drill 3)
  other vias: 3.5,3.26
N$67
  pour Bottom (isolate 0.8): 0,60 170,60 170,0 0,0
N$68
  pour Top (isolate 0.8): 0,0 170,0 170,60 0,60
RST  (via drill 0.5)
  Top 0.5: JP3.4 107.01,54.69 108.91,56.6 115.9,56.6 116.53,55.97 131.78,55.97 138.12,49.61 138.12,42.63 139.08,41.67 R1.1 | S1.2 29.9,44.26 v30.18,44.53
  Bottom 0.5: IC1.9 146.38,32.47 139.54,39.31 R1.1 | v30.18,44.53 30.18,48.34 40.34,58.5 62.56,58.5 69.54,51.52 85.42,51.52 91.13,57.23 104.47,57.23 107.01,54.69 JP3.4
VCC
  Top 0.5: R22.2 32.72,32.47 36.13,35.89 T3.C | C9.- 59.38,54.06 60.66,52.79 60.66,46.28 IC3.16 | R17.2 150.19,5.8 154,9.61 154,22.31 C10.+ | 126.06,36.92 126.06,32.47 131.14,27.39 IC1.30 135.42,27.39 R1.2 | 126.06,36.92 SG1.+ | T1.C T2.C | T4.C T3.C | T3.C 36.53,42 40.97,46.44 56.85,46.44 IC3.16 | T5.C 67.4,35.89 59.38,43.9 59.38,43.91 IC3.16 | R23.2 102.72,32.39 T7.C T8.C 122.49,35.89 123.52,36.92 126.06,36.92
  Bottom 0.5: R22.2 28.91,30.56 27.64,30.56 26.36,31.83 26.36,33.11 23.58,35.89 T2.C | JP3.5 103.84,54.69 103.84,46.44 106.22,44.06 T7.C | 147.65,30.56 147.01,29.93 IC1.10 146.38,29.93 144.79,31.52 R1.2 | 147.65,30.56 152.94,35.85 152.94,37.55 | 152.94,37.55 156.54,37.55 164.16,45.17 L1.2 | 147.65,30.56 154,24.22 154,22.31 C10.+ | R23.2 101.06,31.59 100.03,30.56 98.12,30.56 96.85,31.83 96.85,32.47 93.44,35.89 T6.C T5.C | IC4.4 152.94,37.55